# Altium project bb8.PrjPcb
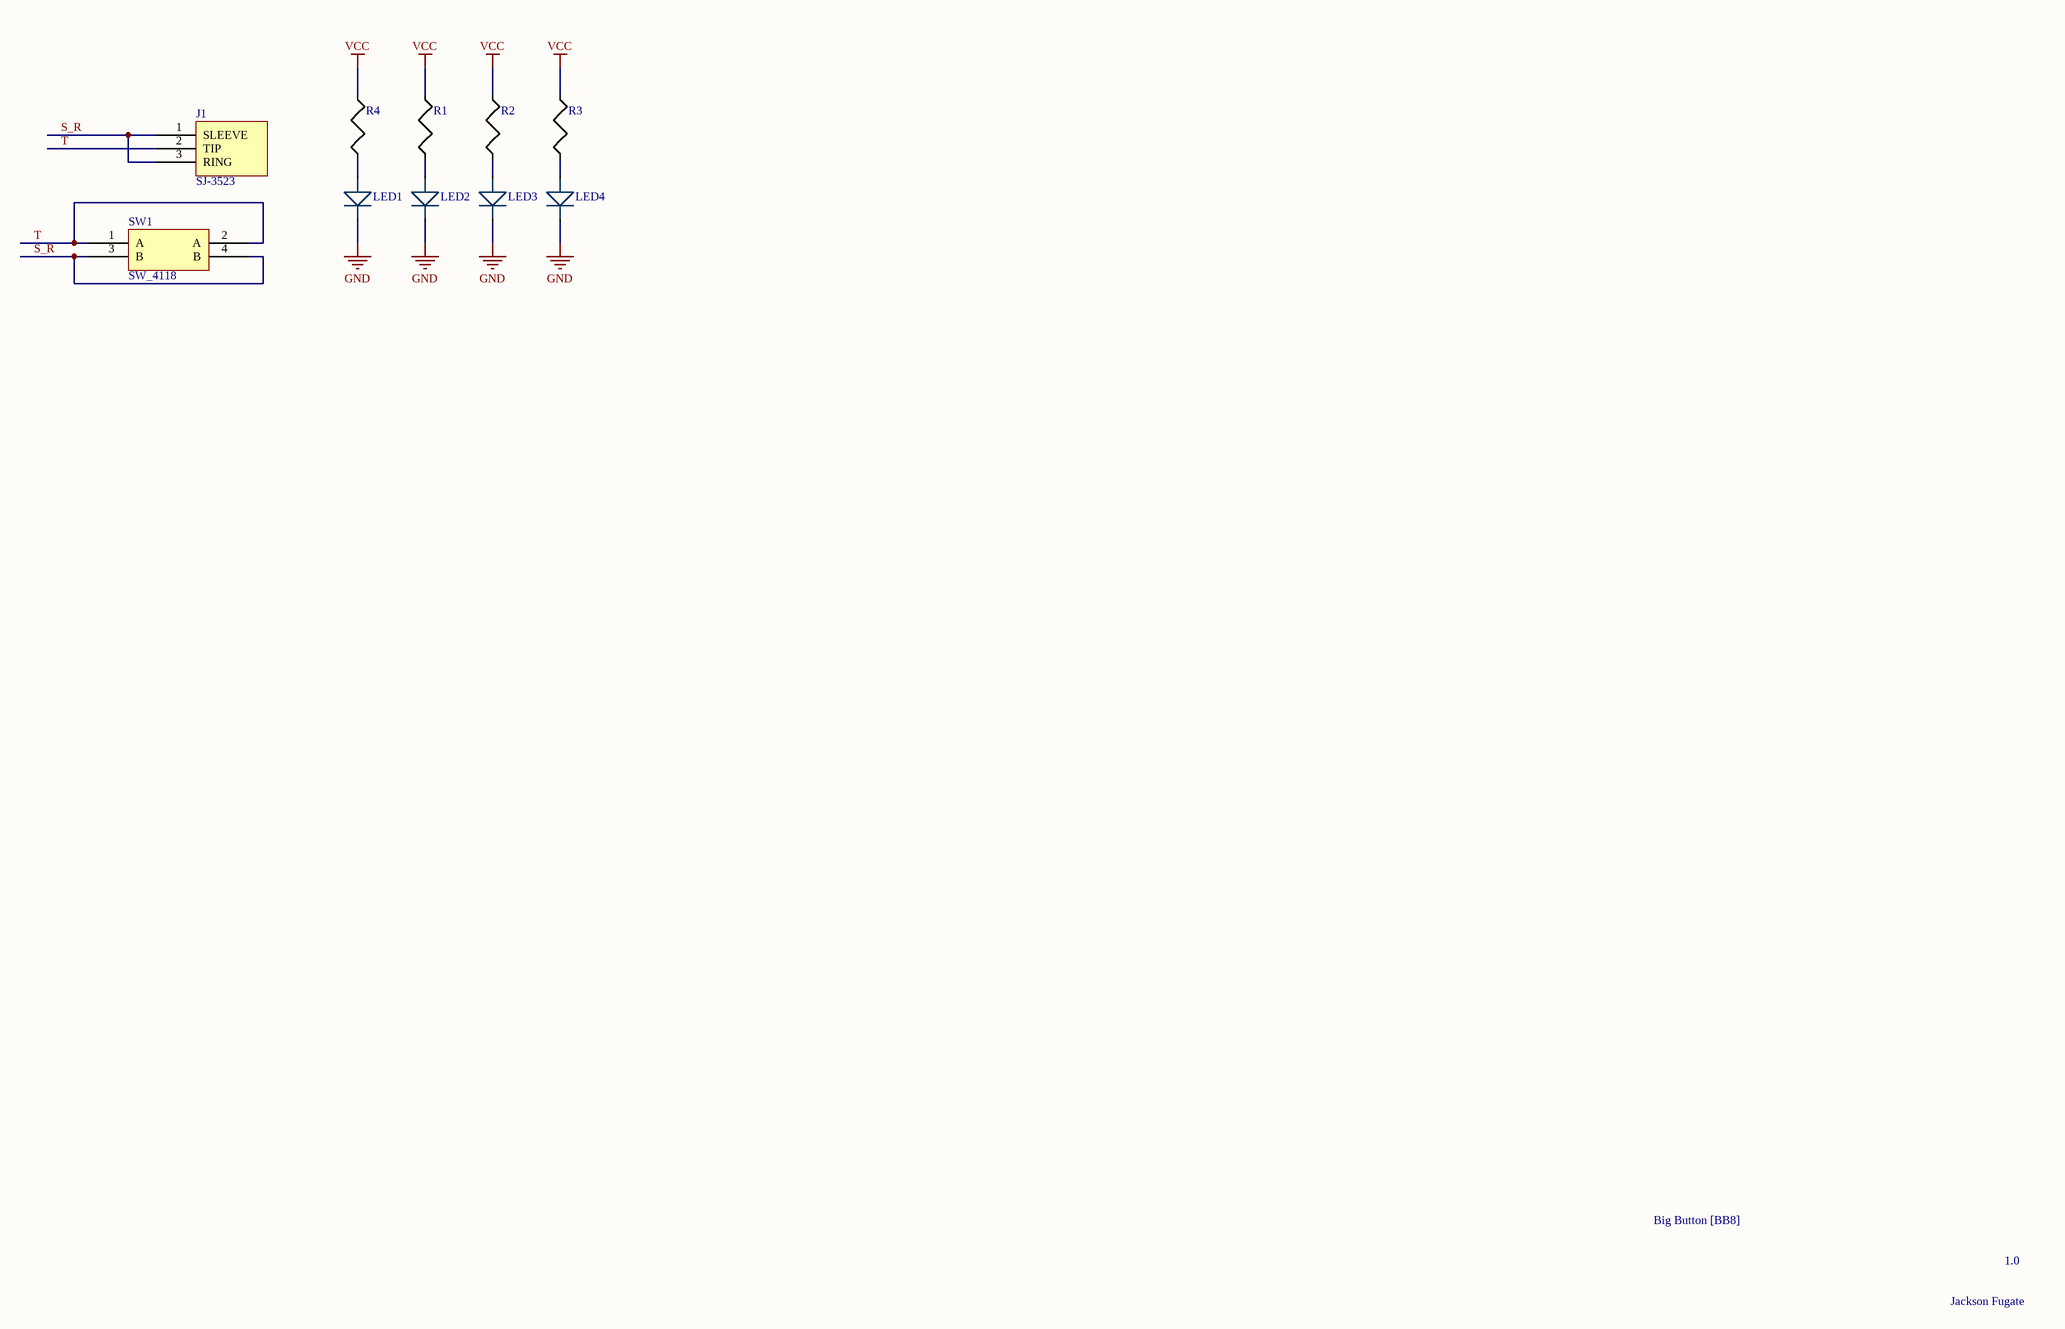
[diagram p0: bb8_v3.SchDoc]
1 sheet, 10 parts. Net scope: global (net labels, ports and power ports of the same name join across sheets).
Board file: bb8_v3.PcbDoc

## Sheet bb8_v3.SchDoc
size 660 x 381 mm; SheetNumber: 1; SheetTotal: 1

### Parts
J1  SJ-3523  [SJ-352X]
LED1  LED?  [LED_TH]  (value not drawn)
LED2  LED?  [LED_TH]  (value not drawn)
LED3  LED?  [LED_TH]  (value not drawn)
LED4  LED?  [LED_TH]  (value not drawn)
R1  RES_GENERIC  [RES_TH]  (value not drawn)
R2  RES_GENERIC  [RES_TH]  (value not drawn)
R3  RES_GENERIC  [RES_TH]  (value not drawn)
R4  RES_GENERIC  [RES_TH]  (value not drawn)
SW1  SW_4118  [SW_4118]

### Nets
GND: LED1.2 LED2.2 LED3.2 LED4.2
VCC: R1.1 R2.1 R3.1 R4.1
S_R: J1.1(SLEEVE) J1.3(RING) SW1.3(B) SW1.4(B)
T: J1.2(TIP) SW1.1(A) SW1.2(A)
NetLED1_1: LED1.1 R4.2
NetLED2_1: LED2.1 R1.2
NetLED3_1: LED3.1 R2.2
NetLED4_1: LED4.1 R3.2

### Notes on the sheet
- Big Button [BB8]
- 1.0
- Jackson Fugate

### Library data of the parts
LED1-LED4 = LED_GENERIC